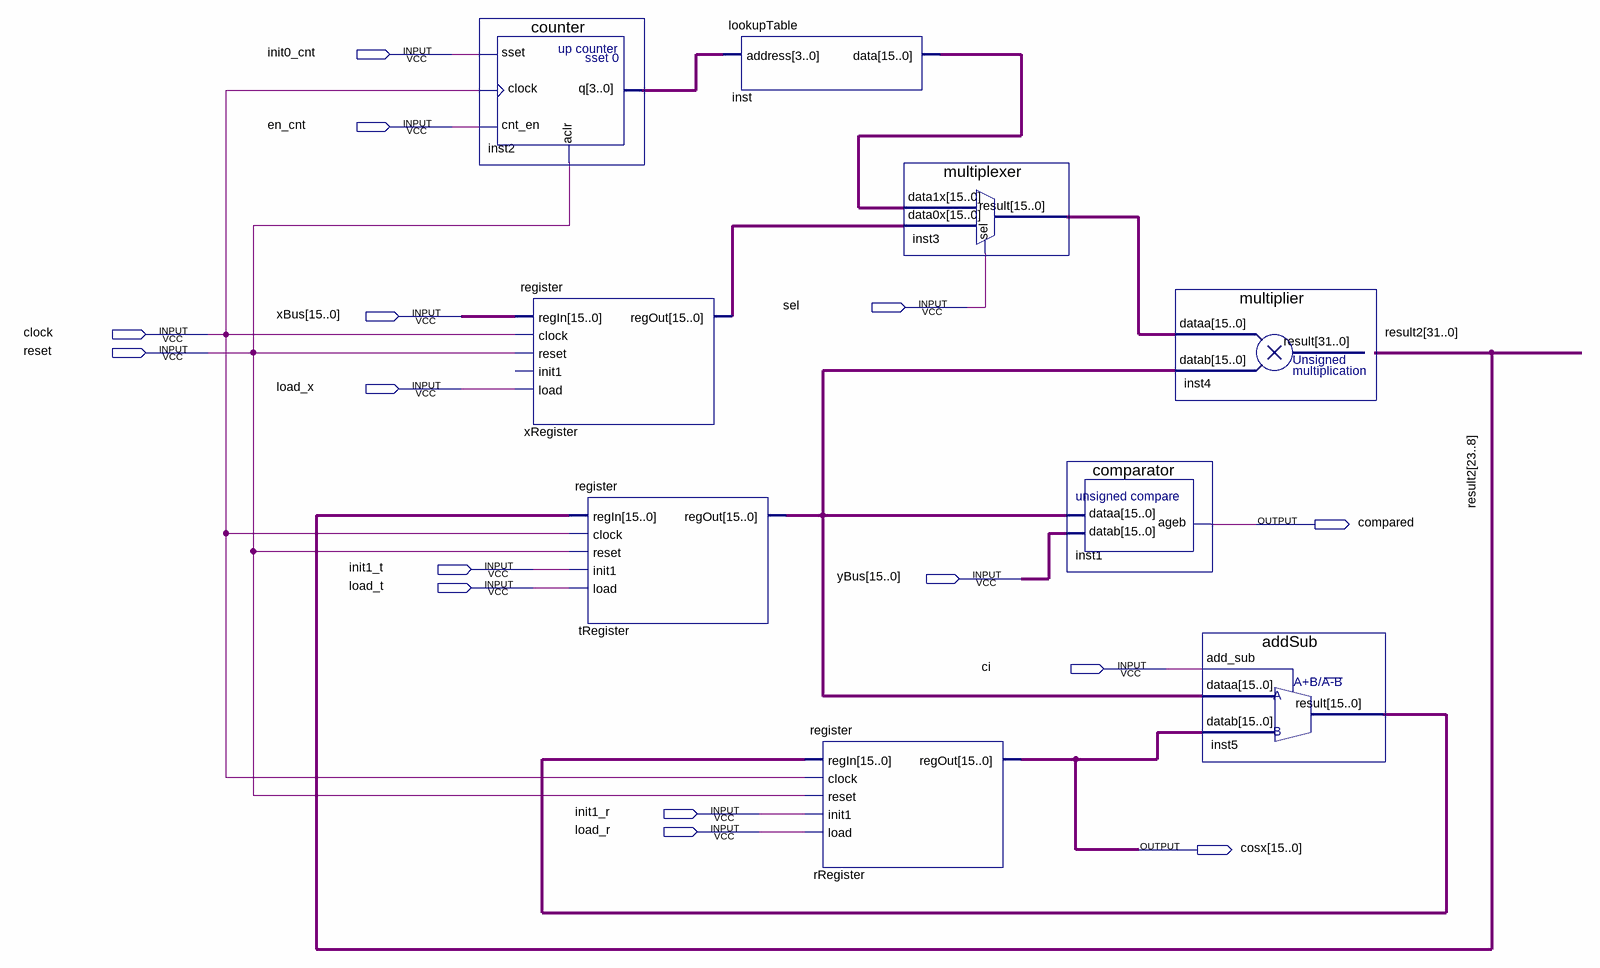
[diagram p0: schematic sheet]
// Quartus schematic dataPath2.bdf as structural Verilog: 9 symbols, 15 pins
module dataPath2 (
  input  init0_cnt,
  input  en_cnt,
  input  sel,
  input  [15:0] xBus,
  input  clock,
  input  reset,
  input  load_x,
  input  init1_t,
  input  [15:0] yBus,
  input  load_t,
  input  ci,
  input  init1_r,
  input  load_r,
  output compared,
  output [15:0] cosx
);

  wire [3:0] inst2_q;
  wire [15:0] inst3_result, inst5_result, inst_data, tRegister_regout, xRegister_regout;
  wire [31:0] result2;

  counter inst2 (.sset(init0_cnt), .clock(clock), .cnt_en(en_cnt), .aclr(reset), .q(inst2_q));
  register xRegister (
    .regIn(xBus), .clock(clock), .reset(reset), .load(load_x), .regOut(xRegister_regout));  // open: init1
  register tRegister (
    .regIn(result2[23:8]), .clock(clock), .reset(reset), .init1(init1_t), .load(load_t),
    .regOut(tRegister_regout));
  lookupTable inst (.address(inst2_q), .data(inst_data));
  register rRegister (
    .regIn(inst5_result), .clock(clock), .reset(reset), .init1(init1_r), .load(load_r), .regOut(cosx));
  multiplexer inst3 (.data1x(inst_data), .data0x(xRegister_regout), .sel(sel), .result(inst3_result));
  comparator inst1 (.dataa(tRegister_regout), .datab(yBus), .ageb(compared));
  multiplier inst4 (.dataa(inst3_result), .datab(tRegister_regout), .result(result2));
  addSub inst5 (.add_sub(ci), .dataa(tRegister_regout), .datab(cosx), .result(inst5_result));
endmodule
